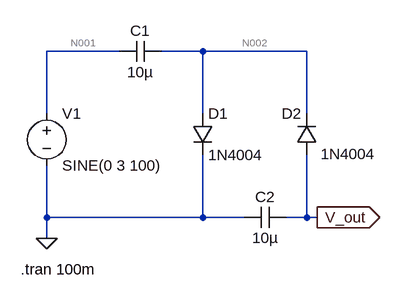
[diagram p0: schematic Multiplicador.asc]
Multiplicador.asc, the LTspice schematic file:
Version 4.1
SHEET 1 880 680
WIRE 176 16 64 16
WIRE 304 16 240 16
WIRE 464 16 304 16
WIRE 64 112 64 16
WIRE 304 112 304 16
WIRE 464 112 464 16
WIRE 64 272 64 192
WIRE 304 272 304 176
WIRE 304 272 64 272
WIRE 368 272 304 272
WIRE 464 272 464 176
WIRE 464 272 432 272
WIRE 480 272 464 272
WIRE 64 304 64 272
FLAG 64 304 0
FLAG 480 272 V_out
IOPIN 480 272 Out
SYMBOL voltage 64 96 R0
WINDOW 123 0 0 Left 0
WINDOW 39 0 0 Left 0
SYMATTR InstName V1
SYMATTR Value SINE(0 3 100)
SYMBOL cap 240 0 R90
WINDOW 0 0 32 VBottom 2
WINDOW 3 32 32 VTop 2
SYMATTR InstName C1
SYMATTR Value 10µ
SYMBOL diode 288 112 R0
SYMATTR InstName D1
SYMATTR Value 1N4004
SYMBOL diode 480 176 R180
WINDOW 0 24 64 Left 2
WINDOW 3 -90 2 Left 2
SYMATTR InstName D2
SYMATTR Value 1N4004
SYMBOL cap 432 256 R90
WINDOW 0 0 32 VBottom 2
WINDOW 3 32 32 VTop 2
SYMATTR InstName C2
SYMATTR Value 10µ
TEXT 24 352 Left 2 !.tran 100m

The netlist it stands for:
* Multiplicador.asc
V1 N001 0 SINE(0 3 100)
C1 N002 N001 10µ
D1 N002 0 1N4004
D2 V_out N002 1N4004
C2 V_out 0 10µ
.model D D
.lib standard.dio
.tran 100m
.backanno
.end

* Results of the author's LTspice run, read from the files saved beside the schematic
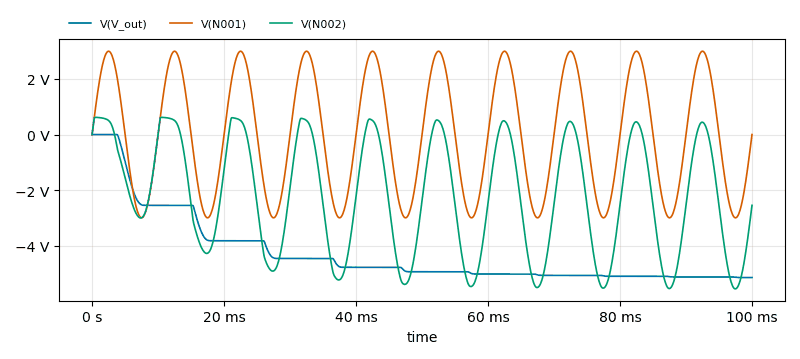
[diagram p1: Transient Analysis of Multiplicador.asc, plotted from the saved traces]
* Transient Analysis, 1 run:
*   V(V_out): min -5.151 V, max 41.26 µV, average -4.298 V, rms 4.485 V, last -5.151 V
*   V(N001): min -3 V, max 3 V, average 8.752 µV, rms 2.121 V, last 0 V
*   V(N002): min -5.558 V, max 619.5 mV, average -2.227 V, rms 3.054 V, last -2.551 V